# EAGLE design disaster01 (EAGLE 9.5.1)
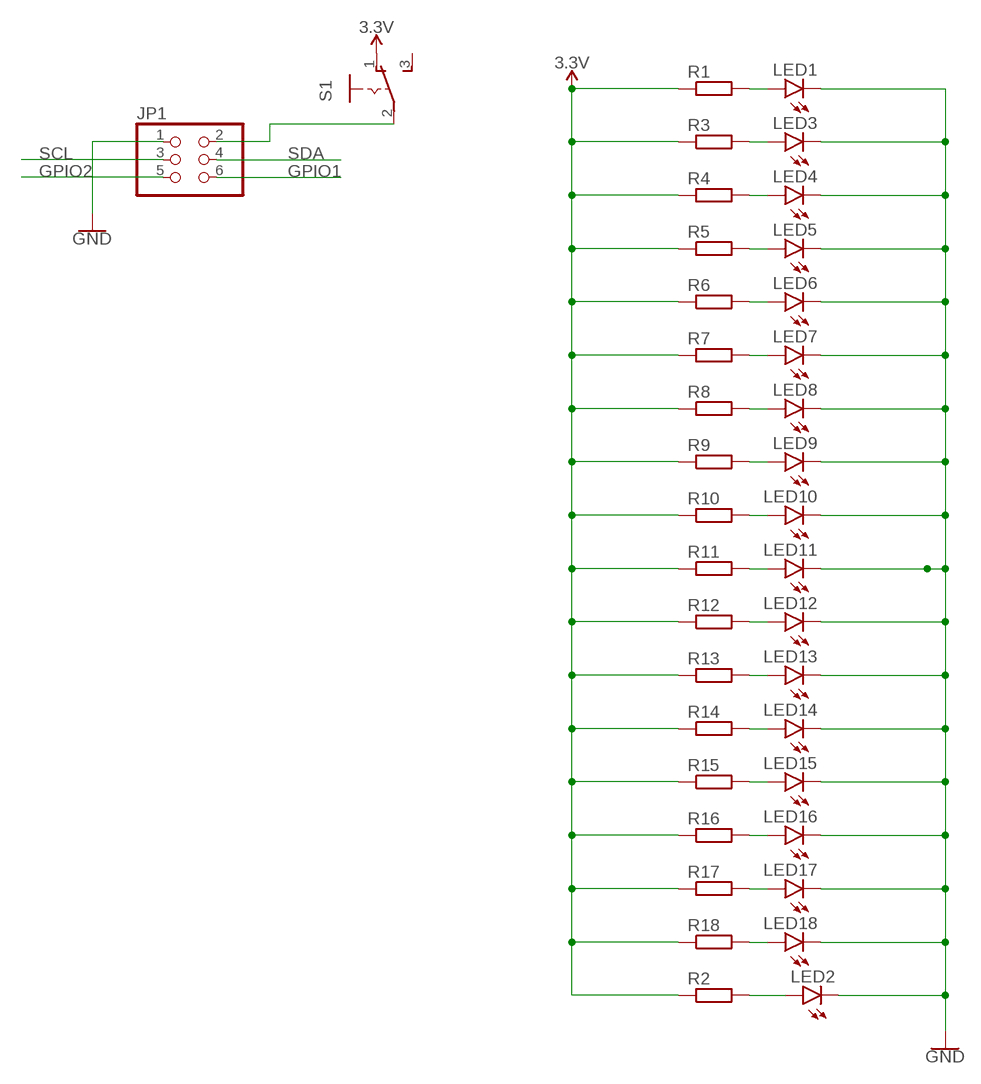
[diagram p0: schematic, sheet 1]

## Parts
JP1  PINHD-2X3  [2X03]
LED1  LED3MM  [LED3MM]
LED2  LED10MM  [LED10MM]
LED3  LED3MM  [LED3MM]
LED4  LED3MM  [LED3MM]
LED5  LED3MM  [LED3MM]
LED6  LED3MM  [LED3MM]
LED7  LED3MM  [LED3MM]
LED8  LED3MM  [LED3MM]
LED9  LED3MM  [LED3MM]
LED10  LED3MM  [LED3MM]
LED11  LED3MM  [LED3MM]
LED12  LED3MM  [LED3MM]
LED13  LED3MM  [LED3MM]
LED14  LED3MM  [LED3MM]
LED15  LED3MM  [LED3MM]
LED16  LED3MM  [LED3MM]
LED17  LED3MM  [LED3MM]
LED18  LED10MM  [LED10MM]
R1  R-EU_R0402  [R0402]
R2  R-EU_R0402  [R0402]
R3  R-EU_R0402  [R0402]
R4  R-EU_R0402  [R0402]
R5  R-EU_R0402  [R0402]
R6  R-EU_R0402  [R0402]
R7  R-EU_R0402  [R0402]
R8  R-EU_R0402  [R0402]
R9  R-EU_R0402  [R0402]
R10  R-EU_R0402  [R0402]
R11  R-EU_R0402  [R0402]
R12  R-EU_R0402  [R0402]
R13  R-EU_R0402  [R0402]
R14  R-EU_R0402  [R0402]
R15  R-EU_R0402  [R0402]
R16  R-EU_R0402  [R0402]
R17  R-EU_R0402  [R0402]
R18  R-EU_R0402  [R0402]
S1  255SB  [255SB]

## Nets
3.3V: R1.1 R2.1 R3.1 R4.1 R5.1 R6.1 R7.1 R8.1 R9.1 R10.1 R11.1 R12.1 R13.1 R14.1 R15.1 R16.1 R17.1 R18.1 S1.1(O)
GND: JP1.1 LED1.K(C) LED2.K(C) LED3.K(C) LED4.K(C) LED5.K(C) LED6.K(C) LED7.K(C) LED8.K(C) LED9.K(C) LED10.K(C) LED11.K(C) LED12.K(C) LED13.K(C) LED14.K(C) LED15.K(C) LED16.K(C) LED17.K(C) LED18.K(C)
GPIO1: JP1.6
GPIO2: JP1.5
N$1: LED1.A R1.2
N$2: LED2.A R2.2
N$3: LED3.A R3.2
N$4: LED4.A R4.2
N$5: LED5.A R5.2
N$6: LED6.A R6.2
N$7: LED7.A R7.2
N$8: LED8.A R8.2
N$9: LED9.A R9.2
N$10: LED10.A R10.2
N$11: LED11.A R11.2
N$12: LED12.A R12.2
N$13: LED13.A R13.2
N$14: LED14.A R14.2
N$15: LED15.A R15.2
N$16: LED16.A R16.2
N$17: LED17.A R17.2
N$18: LED18.A R18.2
N$166: JP1.2 S1.2(P)
SCL: JP1.3
SDA: JP1.4
Unconnected: S1.3(S)

## Library data of the parts
JP1 = pinhead:PINHD-2X3: PIN HEADER
LED1-LED18 = led:LED: LED OSRAM: - CHIPLED LG R971, LG N971, LY N971, LG Q971, LY Q971, LO R971, LY R971 LH N974, LH R974 LS Q976, LO Q976, LY Q976 LO Q996 - Hyper CHIPLED LW Q18S LB Q993, LB Q99A, LB R99A - SideLED LS A670, LO A670, LY A670, LG A670, LP A670 LB A673, LV A673, LT A673, LW A673 LH A674 LY A675 LS A676, LA A676, LO A676, LY A676, LW A676 LS A679, LY A679, LG A679 - Hyper Micro SIDELED® LS Y876, LA Y876, LO Y876, LY Y876 LT Y87S - SmartLED LW L88C, LW L88S LB L89C, LB L89S, LG L890 LS L89K, LO L89K, LY L89K LS L896, LA L896, LO L896, LY L896 - TOPLED LS T670, LO T670, LY T670, LG T670, LP T670 LSG T670, LSP T670, LSY T670, LOP T670, LYG T670 LG T671, LOG T671, LSG T671 LB T673, LV T673, LT T673, LW T673 LH T674 LS T676, LA T676, LO T676, LY T676, LB T676, LH T676, LSB T676, LW T676 LB T67C, LV T67C, LT T67C, LS T67K, LO T67K, LY T67K, LW E67C LS E67B, LA E67B, LO E67B, LY E67B, LB E67C, LV E67C, LT E67C LW T67C LS T679, LY T679, LG T679 LS T770, LO T770, LY T770, LG T770, LP T770 LB T773, LV T773, LT T773, LW T773 LH T774 LS E675, LA E675, LY E675, LS T675 LS T776, LA T776, LO T776, LY T776, LB T776 LHGB T686 LT T68C, LB T68C - Hyper Mini TOPLED® LB M676 - Mini TOPLED Santana® LG M470 LS M47K, LO M47K, LY M47K Source: http://www.osram.convergy.de LUXEON: - LUMILED® LXK2-PW12-R00, LXK2-PW12-S00, LXK2-PW14-U00, LXK2-PW14-V00 LXK2-PM12-R00, LXK2-PM12-S00, LXK2-PM14-U00 LXK2-PE12-Q00, LXK2-PE12-R00, LXK2-PE12-S00, LXK2-PE14-T00, LXK2-PE14-U00 LXK2-PB12-K00, LXK2-PB12-L00, LXK2-PB12-M00, LXK2-PB14-N00, LXK2-PB14-P00, LXK2-PB14-Q00 LXK2-PR12-L00, LXK2-PR12-M00, LXK2-PR14-Q00, LXK2-PR14-R00 LXK2-PD12-Q00, LXK2-PD12-R00, LXK2-PD12-S00 LXK2-PH12-R00, LXK2-PH12-S00 LXK2-PL12-P00, LXK2-PL12-Q00, LXK2-PL12-R00 Source: www.luxeon.com KINGBRIGHT: KA-3528ASYC Source: www.kingbright.com
R1-R18 = resistor:R-EU_: RESISTOR, European symbol
S1 = switch:255SB: SLIDING SWITCH Distributor Buerklin, 11G810

## Board
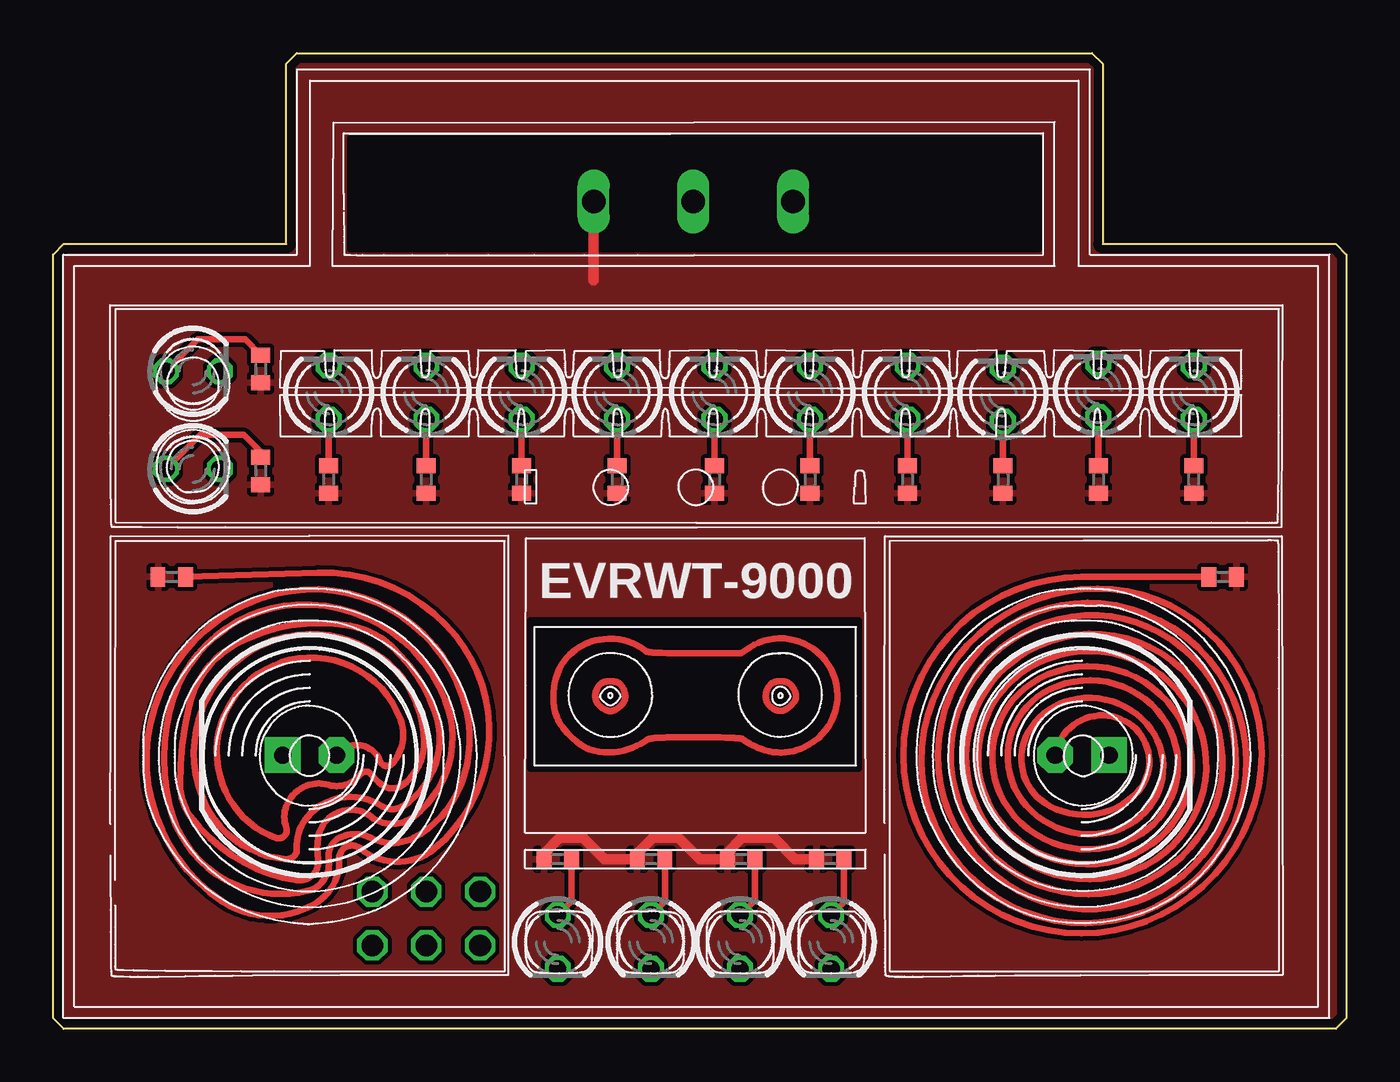
[diagram p1: board, top side]
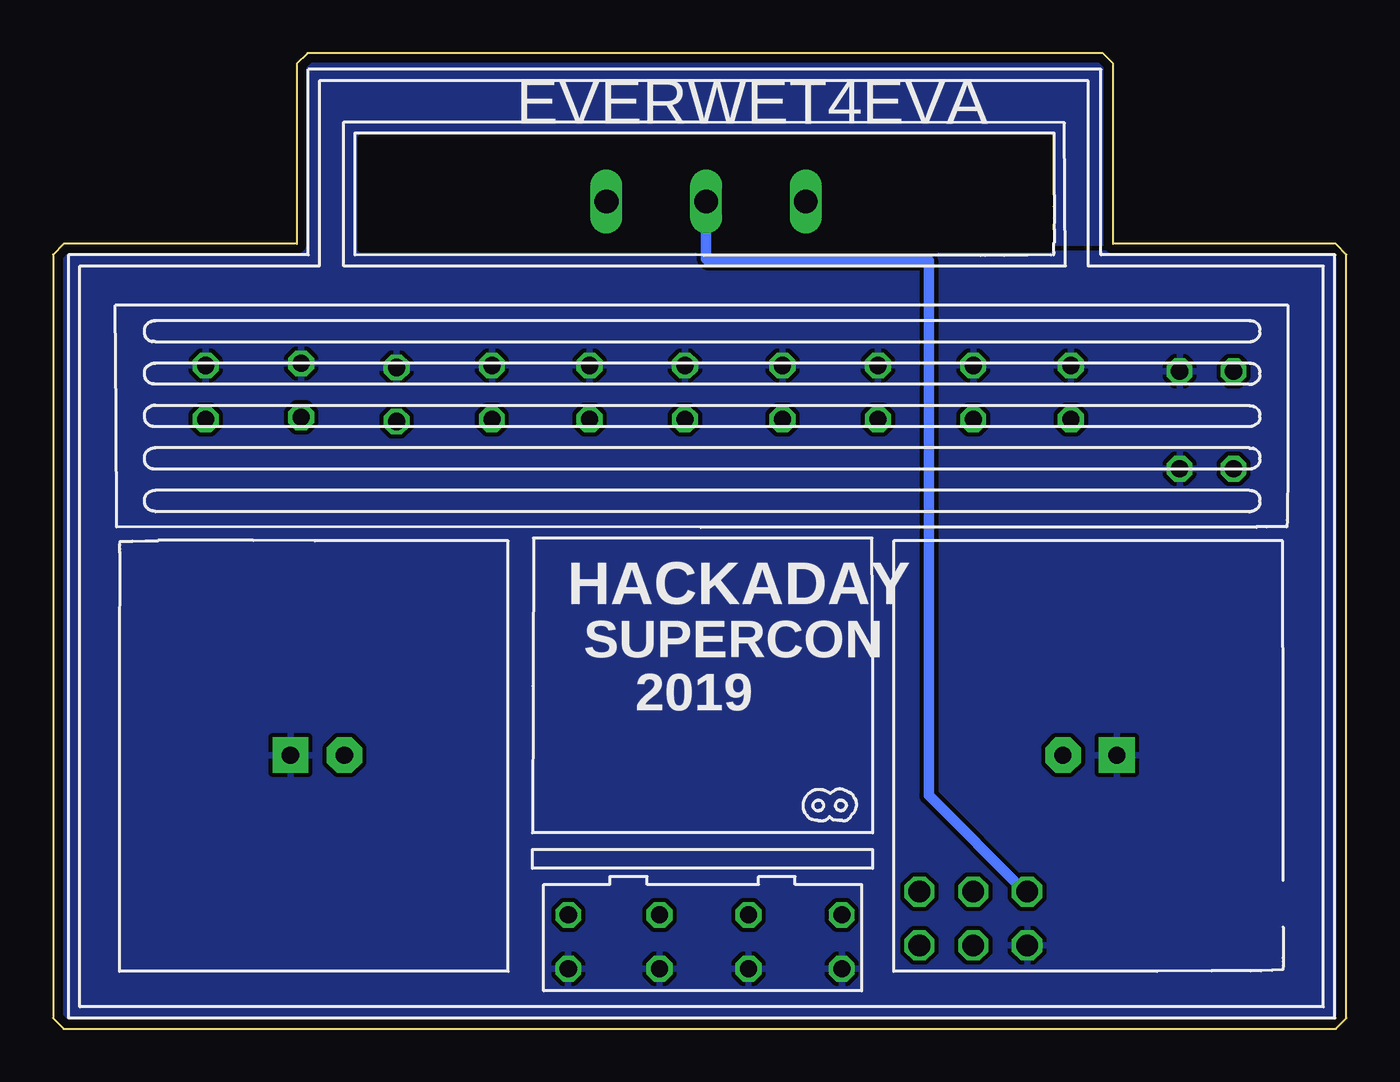
[diagram p2: board, bottom side, seen from below]

Size 61 x 46 mm. Coordinates in mm from the lower left corner, seen from the top.
Outline: 0,0.5 0,36.5 0.5,37 11,37 11,45.5 11.5,46 49,46 49.5,45.5 49.5,37 60.5,37 61,36.5 61,0.5 60.5,0 0.5,0 0,0.5
Copper layers (1*16): Top 0.035mm / dielectric 1.5mm / Bottom 0.035mm
Design rules "default *": minimum track width 0.2mm, minimum drill 0.2mm, track to track 0.2mm, track to pad 0.2mm, pad to pad 0.2mm, via to via 0.2mm, smd to smd 0.2mm, copper to edge 0.4mm, drill to drill 0.2mm, minimum pad ring 0.2mm, minimum via ring 0.2mm, stop-mask expansion 4mil, vias tented up to drill 0mil, thermal gap 0.2mm
bRestrict: area 11.2,36.7 to 14,36.9

### Footprints (pad centres in the part's own frame; a part is rotated, then mirrored left to right if it is on the bottom)
2X03 = drill 1.016 octagon: 1 -2.54,-1.27; 2 -2.54,1.27; 3 0,-1.27; 4 0,1.27; 5 2.54,-1.27; 6 2.54,1.27
LED3MM = drill 0.813 octagon: A -1.27,0; K 1.27,0
LED10MM = drill 0.813 pad 1.676 octagon: A -1.27,0 | drill 0.813 pad 1.676 square: K 1.27,0
R0402 = smd 0.7 x 0.9: 1 -0.65,0; 2 0.65,0
255SB = drill 1.118 long: 1 -4.7,0; 2 0,0; 3 4.7,0

### Placement (x,y rotation side)
JP1  17.6,5.2 0 top
LED1  23.8,4.1 270 top
LED2  12.1,12.9 180 top
LED3  28.2,4.1 270 top
LED4  32.4,4.1 270 top
LED5  36.7,4.1 270 top
LED6  6.6,31 0 top
LED7  6.6,26.4 0 top
LED8  13,30 90 top
LED9  17.6,30 90 top
LED10  22.1,30 90 top
LED11  26.6,30 90 top
LED12  31.2,30 90 top
LED13  35.7,30 90 top
LED14  40.3,30 90 top
LED15  44.8,29.9 90 top
LED16  49.3,30.1 90 top
LED17  53.8,30 90 top
LED18  48.53,12.9 0 top
R1  23.8,8 0 top
R2  5.6,21.3 0 top
R3  28.2,8 0 top
R4  32.45,8 0 top
R5  36.65,8 0 top
R6  9.8,31.1 90 top
R7  9.8,26.3 90 top
R8  13,25.9 90 top
R9  17.6,25.9 90 top
R10  22.1,25.9 90 top
R11  26.6,25.9 90 top
R12  31.2,25.9 90 top
R13  35.7,25.9 90 top
R14  40.3,25.9 90 top
R15  44.8,25.9 90 top
R16  49.3,25.9 90 top
R17  53.8,25.9 90 top
R18  55.15,21.3 180 top
S1  30.2,39 0 top

### Tracks (layer width: path | path; a pad name or v marks a point on that pad's centre or on a via)
3.3V
  Top 0.5: R5.1 35,8 34,9 32.5,9 31.8,8.3 R4.1 30.5,8 29.5,9 28.3,9 27.55,8.25 R3.1 26,8 25,9 23.9,9 23.15,8.25 R1.1 | S1.1 25.5,35.3
  pour Top (rank 2): 0,0 0,37 11,37 11,46 49.5,46 49.5,37 61,37 61,0
GND
  pour Bottom: 0,0 0,37 11,37 11,46 49.5,46 49.5,37 61,37 61,0
N$1
  Top 0.3: R1.2 24.45,6.02 LED1.A
N$2
  Top 0.3: R2.2 12.5,21.5 arc-53 19,18.5 arc-47 20.5,13 arc-42 18,8.5 arc-80 14.5,8.5 arc133 13.5,8 arc-59 12.5,6 arc-67 8,6 arc-48 4.5,11.5 arc-85 10.5,20.5 arc-91 19.5,15 arc-41 19,11 arc-35 17,9 arc-55 15,9 arc55 13.5,9 arc72 13,8 arc-86 12,6.5 arc-26 9.5,6.5 arc-64 5.5,10.5 arc-26 5.5,15 arc-74 11.5,20 arc-71 18.5,15.5 arc-74 17,10 arc-76 15,10 arc119 12.5,9 arc17 12.5,8 arc-107 11.5,7 arc-45 6.5,10 arc-37 6,11.5 arc-13 6.41,15.22 arc-48 8.57,18.09 arc-39 14,19 arc-33 16,18 arc-27 18,15 arc-78 16.5,10.5 arc-66 15.5,10.5 arc82 12,10 arc45 11.5,8.5 arc-98 11,8 arc-66 7,11 arc-52 7.5,16 arc-95 15.5,17.5 arc-53 17.5,13.5 arc-53 16.5,11.5 arc-73 15.5,11.5 arc-17 15,12 arc107 14.5,12 arc-70 13,11.5 arc86 11,10.5 arc41 11,9.5 arc-131 10.5,9 arc-49 8,11.5 arc-108 12,17.5 arc-72 16.39,14.58 arc-62 16,12.5 arc-118 15.43,12.61 arc123 LED2.A
N$3
  Top 0.3: R3.2 28.85,6.02 LED3.A
N$4
  Top 0.3: R4.2 33.1,6.07 LED4.A
N$5
  Top 0.3: R5.2 37.3,5.97 LED5.A
N$6
  Top 0.3: LED6.A 6.83,32.5 9.05,32.5 R6.2
N$7
  Top 0.3: LED7.A 6.93,28 9,28 9.8,27.2 R7.2
N$8
  Top 0.3: R8.2 LED8.A
N$9
  Top 0.3: R9.2 LED9.A
N$10
  Top 0.3: R10.2 LED10.A
N$11
  Top 0.3: R11.2 LED11.A
N$12
  Top 0.3: R12.2 LED12.A
N$13
  Top 0.3: R13.2 LED13.A
N$14
  Top 0.3: R14.2 LED14.A
N$15
  Top 0.3: R15.2 LED15.A
N$16
  Top 0.3: R16.2 LED16.A
N$17
  Top 0.3: R17.2 LED17.A
N$18
  Top 0.3: R18.2 48.5,21.3 arc90 40.1,12.9 arc90 48.5,4.5 arc90 57,13 arc90 49.25,20.75 arc68 41.5,15.5 arc107 48,5 arc73 55.75,9.79 arc107 49.4,20.05 arc60 43,17 arc95 45.5,6.5 arc85 54.58,8.66 arc95 52.2,18.67 arc85 43.48,16.59 arc76 44,8.5 arc103 54,9 arc77 53.62,16.56 arc84 45.5,17.5 arc96 44.5,9 arc82 52,8 arc98 53.06,15.93 arc80 46,17 arc100 44.86,9.52 arc80 51.5,8.5 arc100 52.56,15.41 arc77 46.5,16.5 arc103 45.34,10.03 arc77 51,9 arc103 52.09,14.98 arc75 47,16 arc105 45.91,10.52 arc72 50.5,9.5 arc108 51.58,14.37 arc62 48,15.5 arc47 46,14 arc92 47,10.5 arc71 51,11 arc109 50.56,14.51 arc109 LED18.A
N$19
  cutout Top (isolate 0.5): 22.5,19.25 38,19.25 38,12.25 22.5,12.25
N$20
  cutout Top (isolate 0.5): 14,42 46.5,42 46.5,36.75 14,36.75
N$21
  Top 0.3: 36.24,17.58 arc79 32.84,17.97
N$22
  Top 0.3: 34.54,13.03 arc20 35.45,13.29
N$23
  Top 0.3: 33.15,13.29 arc5 33.38,13.2
N$24
  Top 0.3: 27.45,18.13 arc7 27.18,18.24
N$25
  Top 0.3: 25.95,18.37 arc20 25.07,18.12
N$26
  Top 0.3: 26.9,13.12 arc22 27.91,13.56
N$27
  Top 0.3: 25.11,13.26 arc8 25.26,13.19
N$28
  Top 0.3: 35.45,13.29 arc109 36.24,17.58
N$29
  Top 0.3: 23.9,17 arc12 23.7,16.48
N$30
  Top 0.3: 23.7,16.48 arc11 23.61,15.89
N$31
  Top 0.3: 23.82,14.56 arc6 23.92,14.38
N$32
  Top 0.3: 33.38,13.19 arc26 34.54,13.03
N$33
  Top 0.3: 32.33,13.69 arc2 32.17,13.71
N$34
  Top 0.3: 32.44,13.68 arc4 32.33,13.69
N$35
  Top 0.3: 32.55,13.64 arc35 32.44,13.68
N$36
  Top 0.3: 32.55,13.64 arc14 32.56,13.62
N$37
  Top 0.3: 32.56,13.62 arc6 32.59,13.6
N$38
  Top 0.3: 32.59,13.6 arc3 32.63,13.57
N$39
  Top 0.3: 32.63,13.57 arc2 32.69,13.54
N$40
  Top 0.3: 32.69,13.54 arc1 32.75,13.5
N$41
  Top 0.3: 32.75,13.5 arc1 32.82,13.46
N$42
  Top 0.3: 32.82,13.46 arc1 32.89,13.42
N$43
  Top 0.3: 32.89,13.42 arc3 33.15,13.29
N$44
  Top 0.3: 32.18,13.71 arc1 31.98,13.72
N$45
  Top 0.3: 28.14,17.75 arc3 28.28,17.74
N$46
  Top 0.3: 28.47,17.73 arc1 28.7,17.72
N$47
  Top 0.3: 28.28,17.74 arc2 28.46,17.73
N$48
  Top 0.3: 28.04,17.77 arc6 28.14,17.75
N$49
  Top 0.3: 27.92,17.83 arc26 28.04,17.77
N$50
  Top 0.3: 27.93,17.83 arc9 27.7,17.99
N$51
  Top 0.3: 27.7,18 arc8 27.45,18.14
N$52
  Top 0.3: 28.27,13.7 arc6 28.15,13.68
N$53
  Top 0.3: 28.05,13.65 arc15 27.91,13.56
N$54
  Top 0.3: 28.15,13.68 arc8 28.06,13.65
N$55
  Top 0.3: 28.44,13.71 arc3 28.27,13.7
N$56
  Top 0.3: 28.66,13.73 arc2 28.44,13.71
N$57
  Top 0.3: 28.94,13.73 arc1 28.66,13.73
N$58
  Top 0.3: 27.17,18.24 arc24 25.96,18.37
N$59
  Top 0.3: 25.53,13.11 arc27 26.91,13.12
N$60
  Top 0.3: 25.27,13.19 arc6 25.53,13.11
N$61
  Top 0.3: 24.82,17.98 arc32 23.9,17
N$62
  Top 0.3: 25.07,18.13 arc6 24.82,17.98
N$63
  Top 0.3: 23.61,15.89 arc3 23.6,15.63
N$64
  Top 0.3: 23.6,15.63 arc4 23.61,15.39
N$65
  Top 0.3: 23.61,15.39 arc5 23.63,15.16
N$66
  Top 0.3: 23.63,15.16 arc18 23.82,14.56
N$67
  Top 0.3: 24.05,14.19 arc8 24.37,13.83
N$68
  Top 0.3: 24.38,13.82 arc4 24.56,13.65
N$69
  Top 0.3: 24.56,13.65 arc4 24.75,13.49
N$70
  Top 0.3: 24.75,13.49 arc2 24.84,13.43
N$71
  Top 0.3: 24.84,13.42 arc2 24.93,13.36
N$72
  Top 0.3: 24.93,13.36 arc3 25.02,13.31
N$73
  Top 0.3: 25.02,13.31 arc3 25.11,13.26
N$74
  Top 0.3: 23.92,14.38 arc5 24.05,14.19
N$75
  Top 0.3: 28.98,17.71 29.34,17.71
N$76
  Top 0.3: 30.26,17.71 32.45,17.71
N$77
  Top 0.3: 32.45,17.71 32.85,17.97
N$78
  Top 0.3: 29.76,17.71 30.26,17.71
N$79
  Top 0.3: 29.34,17.71 29.76,17.71
N$80
  Top 0.3: 28.7,17.72 28.98,17.71
N$81
  Top 0.3: 28.95,13.73 29.32,13.74
N$82
  Top 0.3: 29.32,13.74 30.32,13.74
N$83
  Top 0.3: 30.32,13.74 30.74,13.74
N$84
  Top 0.3: 31.12,13.74 31.45,13.73
N$85
  Top 0.3: 31.45,13.73 31.73,13.73
N$86
  Top 0.3: 31.73,13.73 31.97,13.72
N$87
  Top 0.3: 30.74,13.74 31.12,13.74
N$88
  Top 0.3: 25.27,13.19
N$89
  Top 0.3: 26.28,16.39 arc4 26.19,16.39
N$90
  Top 0.3: 26.19,16.39 arc5 26.1,16.38
N$91
  Top 0.3: 26.12,15.01 arc3 26.16,15
N$92
  Top 0.3: 26.16,15 arc4 26.21,14.98
N$93
  Top 0.3: 26.21,14.98 arc12 26.28,14.98
N$94
  Top 0.3: 26.99,15.63 arc9 26.99,15.72
N$95
  Top 0.3: 26.99,15.72 arc23 26.86,16.09
N$96
  Top 0.3: 25.59,15.83 arc26 25.59,15.55
N$97
  Top 0.3: 26.86,16.09 arc6 26.81,16.18
N$98
  Top 0.3: 26.81,16.18 arc8 26.75,16.24
N$99
  Top 0.3: 26.75,16.24 arc25 26.63,16.33
N$100
  Top 0.3: 26.63,16.33 arc4 26.6,16.34
N$101
  Top 0.3: 26.6,16.34 arc3 26.57,16.35
N$102
  Top 0.3: 26.57,16.35 arc2 26.54,16.36
N$103
  Top 0.3: 26.54,16.36 arc2 26.5,16.36
N$104
  Top 0.3: 26.5,16.36 arc5 26.39,16.38
N$105
  Top 0.3: 26.39,16.38 arc2 26.35,16.39
N$106
  Top 0.3: 26.35,16.39 arc4 26.28,16.39
N$107
  Top 0.3: 26.28,14.98 arc11 26.36,14.98
N$108
  Top 0.3: 26.36,14.98 arc9 26.45,15.01
N$109
  Top 0.3: 26.45,15.01 arc7 26.53,15.05
N$110
  Top 0.3: 26.53,15.05 arc17 26.78,15.23
N$111
  Top 0.3: 26.78,15.23 arc6 26.85,15.31
N$112
  Top 0.3: 26.85,15.3 arc7 26.9,15.38
N$113
  Top 0.3: 26.9,15.38 arc18 26.98,15.55
N$114
  Top 0.3: 26.98,15.55 arc11 26.99,15.63
N$115
  Top 0.3: 26.1,16.38 arc6 26.03,16.36
N$116
  Top 0.3: 26.03,16.36 arc24 25.84,16.27
N$117
  Top 0.3: 25.84,16.27 arc8 25.79,16.22
N$118
  Top 0.3: 25.79,16.22 arc7 25.74,16.17
N$119
  Top 0.3: 25.74,16.17 arc10 25.66,16.02
N$120
  Top 0.3: 25.66,16.02 arc7 25.61,15.93
N$121
  Top 0.3: 25.61,15.93 arc8 25.59,15.83
N$122
  Top 0.3: 25.86,15.15 arc4 25.9,15.12
N$123
  Top 0.3: 25.9,15.12 arc11 26.07,15.03
N$124
  Top 0.3: 26.07,15.03 arc3 26.12,15.01
N$125
  Top 0.3: 25.59,15.55 arc17 25.66,15.38
N$126
  Top 0.3: 25.66,15.38 arc8 25.71,15.3
N$127
  Top 0.3: 25.71,15.3 arc14 25.86,15.15
N$128
  Top 0.3: 34.47,16.38 arc8 34.29,16.39
N$129
  Top 0.3: 34.29,16.39 arc5 34.2,16.38
N$130
  Top 0.3: 34.1,15.02 arc29 34.36,14.99
N$131
  Top 0.3: 35.04,15.61 arc11 35.04,15.68
N$132
  Top 0.3: 35.04,15.68 arc10 35.03,15.75
N$133
  Top 0.3: 33.61,15.75 arc32 33.67,15.4
N$134
  Top 0.3: 35.03,15.75 arc7 35.01,15.84
N$135
  Top 0.3: 35.01,15.84 arc8 34.92,16.03
N$136
  Top 0.3: 34.92,16.03 arc4 34.88,16.1
N$137
  Top 0.3: 34.88,16.1 arc6 34.84,16.17
N$138
  Top 0.3: 34.84,16.17 arc7 34.79,16.23
N$139
  Top 0.3: 34.79,16.23 arc17 34.68,16.31
N$140
  Top 0.3: 34.68,16.31 arc8 34.62,16.34
N$141
  Top 0.3: 34.62,16.34 arc7 34.55,16.36
N$142
  Top 0.3: 34.55,16.36 arc6 34.47,16.38
N$143
  Top 0.3: 34.36,14.99 arc10 34.45,15.01
N$144
  Top 0.3: 34.45,15.01 arc9 34.54,15.04
N$145
  Top 0.3: 34.54,15.04 arc7 34.62,15.09
N$146
  Top 0.3: 34.62,15.09 arc12 34.8,15.23
N$147
  Top 0.3: 34.8,15.23 arc3 34.88,15.32
N$148
  Top 0.3: 34.88,15.32 arc5 34.94,15.39
N$149
  Top 0.3: 34.94,15.39 arc7 34.99,15.47
N$150
  Top 0.3: 34.99,15.47 arc10 35.02,15.54
N$151
  Top 0.3: 35.02,15.54 arc11 35.04,15.61
N$152
  Top 0.3: 34.2,16.38 arc6 34.11,16.37
N$153
  Top 0.3: 34.11,16.37 arc7 34.03,16.35
N$154
  Top 0.3: 34.03,16.35 arc16 33.89,16.28
N$155
  Top 0.3: 33.89,16.28 arc17 33.78,16.17
N$156
  Top 0.3: 33.78,16.17 arc7 33.73,16.11
N$157
  Top 0.3: 33.73,16.11 arc12 33.66,15.95
N$158
  Top 0.3: 33.66,15.95 arc7 33.63,15.85
N$159
  Top 0.3: 33.63,15.85 arc7 33.61,15.75
N$160
  Top 0.3: 33.92,15.12 arc7 34.01,15.06
N$161
  Top 0.3: 34.01,15.06 arc8 34.1,15.02
N$162
  Top 0.3: 33.67,15.4 arc15 33.77,15.25
N$163
  Top 0.3: 33.77,15.25 arc14 33.92,15.12
N$164
  cutout Bottom (isolate 0.5): 14,42 46.5,42 46.5,36.75 14,36.75
N$166
  Bottom 0.5: S1.2 30.2,36.3 30.1,36.2 19.7,36.2 19.7,11 15.17,6.47 JP1.2

### Text on the board
tPlace: EVRWT-9000
bPlace: EVERWET4EVA | HACKADAY | SUPERCON | 2019